# Altium project KAAI3020_TEST.PrjPcb (part 1 of 3)
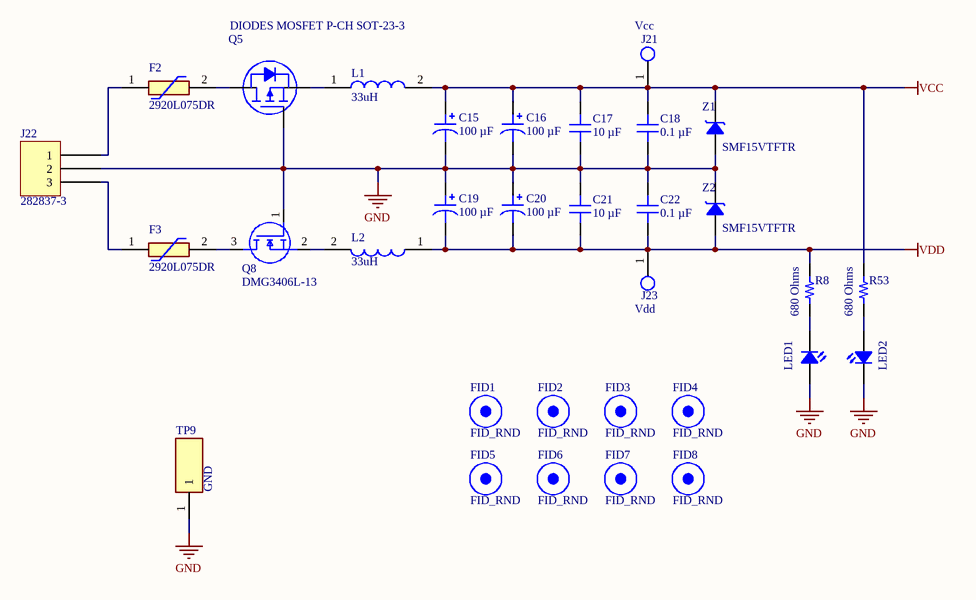
[diagram p0: power.SchDoc]
6 sheets, 253 parts. Net scope: flat (ports and power ports of the same name join across sheets).
Board file: KAAI3020_TESTPcbDoc.PcbDoc
Sheets:
  power.SchDoc
  LDO.SchDoc
  misc_A.SchDoc
  source_A.SchDoc
  source_B.SchDoc
  misc_B.SchDoc

## Sheet power.SchDoc
size A; SheetNumber: 1; SheetTotal: 6

### Parts
C15  100 µF  [CAP ALSMD 8.3MM H10.5MM]
C16  100 µF  [CAP ALSMD 8.3MM H10.5MM]
C17  10 µF  [CAP 1206_3216 - 0.8MM]
C18  0.1 µF  [CAP 1206_3216 - 0.8MM]
C19  100 µF  [CAP ALSMD 8.3MM H10.5MM]
C20  100 µF  [CAP ALSMD 8.3MM H10.5MM]
C21  10 µF  [CAP 1206_3216 - 0.8MM]
C22  0.1 µF  [CAP 1206_3216 - 0.8MM]
F2  2920L075DR  [2920L030DR]
F3  2920L075DR  [2920L030DR]
FID1  FID_RND  [FID_RND]  (no BOM)
FID2  FID_RND  [FID_RND]  (no BOM)
FID3  FID_RND  [FID_RND]  (no BOM)
FID4  FID_RND  [FID_RND]  (no BOM)
FID5  FID_RND  [FID_RND]  (no BOM)
FID6  FID_RND  [FID_RND]  (no BOM)
FID7  FID_RND  [FID_RND]  (no BOM)
FID8  FID_RND  [FID_RND]  (no BOM)
J21  Vcc  [FP-5001-MFG]
J22  282837-3  [TE 282837-3]
J23  Vdd  [FP-5001-MFG]
L1  33uH  [INDPM116102X400N]
L2  33uH  [INDPM116102X400N]
LED1  LTST-C191KRKT  [LEDC1608X55N]  (value not drawn)
LED2  LTST-C191KRKT  [LEDC1608X55N]  (value not drawn)
Q5  DIODES MOSFET P-CH SOT-23-3  [DIODES SOT-23-3]
Q8  DMG3406L-13  [SOT96P240X110-3N]
R8  680 Ohms  [YAGEO RES 1206_3216]
R53  680 Ohms  [YAGEO RES 1206_3216]
TP9  GND  [S175146R]
Z1  SMF15VTFTR  [SMF15VTFTR]
Z2  SMF15VTFTR  [SMF15VTFTR]

### Nets
GND: C15.2 C16.2 C17.1 C18.1 C19.1 C20.1 C21.2 C22.2 J22.2 LED1.2(A) LED2.1(K) Q5.1(G) Q8.1(G) TP9.1 Z1.2 Z2.1
VCC: C15.1 C16.1 C17.2 C18.2 J21.1 L1.2 R53.2 Z1.1
VDD: C19.2 C20.2 C21.1 C22.1 J23.1 L2.1 R8.2 Z2.2
NetF2_1: F2.1 J22.1
NetF2_2: F2.2 Q5.3(D)
NetF3_1: F3.1 J22.3
NetF3_2: F3.2 Q8.3(D)
NetL1_1: L1.1 Q5.2(S)
NetL2_2: L2.2 Q8.2(S)
NetLED1_1: LED1.1(K) R8.1
NetLED2_2: LED2.2(A) R53.1

### Library data of the parts
C15 C16 C19 C20 = 50TZV100M8X10.5: CAP ALUM 100UF 20% 50V SMD; manufacturer: Rubycon; Impedance: 340 mOhms; Lifetime @ Temp.: 2000 Hrs @ 105°C; Polarization: Polar; Ripple Current @ High Frequency: 350 mA @ 100 kHz; Ripple Current @ Low Frequency: 175 mA @ 120 Hz; Surface Mount Land Size: 0.327" L x 0.327" W (8.30mm x 8.30mm); Part Number: 50TZV100M8X10.5; Applications: Automotive; Capacitance: 100 µF; componentlink1description: Datasheet; componentlink1url: http://www.rubycon.co.jp/en/catalog/e_pdfs/aluminum/e_tzv.pdf; componentlink2description: DigiKey Link; componentlink2url: https://www.digikey.com/en/products/detail/rubycon/50TZV100M8X10-5/3134931; Device Package: Radial, Can - SMD; Height - Seated (Max): 0.413" (10.50mm); lastupdated: 6/3/2024 20:15:48; Lifecycle Status: Active; Minimum Order: 1; Mounting Type: Surface Mount; Operating Temperature: -55°C ~ 105°C; Package / Case: Radial, Can - SMD; packaging: TapeAndReel; partid: 7533; Part Status: Active; price: 0.16; Ratings: AEC-Q200; series: TZV; Size / Dimension: 0.315" Dia (8.00mm); Supplier 1: DigiKey; Supplier Part Number 1: 1189-1651-1-ND; Tolerance: ±20%; value: 100 µF; Voltage - Rated: 50 V
C17 C21 = 885012208069: CAP CER 10UF 25V X7R 1206; manufacturer: Würth Elektronik; Tolerance: ±10%; Part Number: 885012208069; Capacitance: 10 µF; Applications: General Purpose; componentlink1description: Datasheet; componentlink1url: https://katalog.we-online.de/pbs/datasheet/885012208069.pdf; componentlink2description: DigiKey Link; componentlink2url: https://www.digikey.com/en/products/detail/würth-elektronik/885012208069/5453429; Device Package: 1206 (3216 Metric); lastupdated: 6/4/2024 19:10:32; Lifecycle Status: Active; Minimum Order: 1; Mounting Type: Surface Mount, MLCC; Operating Temperature: -55°C ~ 125°C; Package / Case: 1206 (3216 Metric); packaging: TapeAndReel; partid: 43199; Part Status: Active; price: 0.40; series: WCAP-CSGP; Size / Dimension: 0.126" L x 0.063" W (3.20mm x 1.60mm); Supplier 1: DigiKey; Supplier Part Number 1: 732-7574-1-ND; Temperature Coefficient: X7R; Thickness (Max): 0.075" (1.90mm); value: 10 µF; Voltage - Rated: 25V
C18 C22 = 885012208087: CAP CER 0.1UF 50V X7R 1206; manufacturer: Würth Elektronik; Tolerance: ±10%; Part Number: 885012208087; Capacitance: 0.1 µF; Applications: General Purpose; componentlink1description: Datasheet; componentlink1url: https://katalog.we-online.de/pbs/datasheet/885012208087.pdf; componentlink2description: DigiKey Link; componentlink2url: https://www.digikey.com/en/products/detail/würth-elektronik/885012208087/5453982; Device Package: 1206 (3216 Metric); lastupdated: 6/4/2024 19:10:27; Lifecycle Status: Active; Minimum Order: 1; Mounting Type: Surface Mount, MLCC; Operating Temperature: -55°C ~ 125°C; Package / Case: 1206 (3216 Metric); packaging: TapeAndReel; partid: 20879; Part Status: Active; price: 0.06; series: WCAP-CSGP; Size / Dimension: 0.126" L x 0.063" W (3.20mm x 1.60mm); Supplier 1: DigiKey; Supplier Part Number 1: 732-8127-1-ND; Temperature Coefficient: X7R; Thickness (Max): 0.035" (0.90mm); value: 0.1 µF; Voltage - Rated: 50V
F2 F3 = 2920L075DR: Resettable Fuse; Manufacturer_Name: LITTELFUSE; Datasheet Link: https://www.littelfuse.com/~/media/electronics/datasheets/resettable_ptcs/littelfuse_ptc_2920l_datasheet.pdf.pdf; Height: 1.25mm; Manufacturer_Part_Number: 2920L075DR; Mouser Part Number: 576-2920L075; Mouser Price/Stock: https://www.mouser.co.uk/ProductDetail/Littelfuse/2920L075DR?qs=SJZ%252BTX%252BI2BR6aMN5vUbCzw%3D%3D; Arrow Part Number: 2920L075DR; Arrow Price/Stock: https://www.arrow.com/en/products/2920l075dr/littelfuse?utm_currency=USD&region=europe
FID1-FID8 = CMP-0288-0A: Fiducial, Round, D=4mm (inner D=1mm); Manufacturer: KONČAR; ManufacturerPartNumber: FID_RND; MountingType: SMD; PartStatus: Active; ValueNumeric: FID_RND; Component Type: Mechanical Parts; Value: FID_RND
J21 J23 = 5001: PC TEST POINT MINIATURE BLACK; Body Material: Bronze; Plating: Silver; Inside Diameter: 1.27mm; Hole Diameter: 1.6mm; Number of Ports: 1; Outside Diameter: 2.54mm; Insulation: Insulated; Insulation Material: Nylon; Mount: Through Hole; RoHS Compliant: Yes; Series: THM; Height: 0.3inch; Termination: Through Hole; Material: Nylon; Packaging: Bulk; Contact Material: Bronze; REACH SVHC: No SVHC; Contact Plating: Silver; Orientation: Straight; Lead Free: Lead Free; Package Quantity: 100; Length: 7.62mm; Flammability Rating: UL94 V-0; Number of Contacts: 1; Diameter: 2.54mm; Housing Color: Black; Color: Black; Supplier 1: Mouser; Supplier Part Number 1: 534-5001
J22 = 282837-3: TERM BLK 3P SIDE ENT 5.08MM PCB; Manufacturer: TE Connectivity AMP Connectors; Current: 13.5 A; Mating Orientation: Horizontal with Board; Number of Levels: 1; Pitch: 0.200" (5.08mm); Positions Per Level: 3; Voltage: 300 V; Wire Gauge: 16-28 AWG; Wire Termination: Screw - Rising Cage Clamp; Part Number: 282837-3; Color: Green; ComponentLink1Description: Datasheet; ComponentLink1URL: https://www.te.com/commerce/DocumentDelivery/DDEController?Action=srchrtrv&DocNm=282837&DocType=Customer+Drawing&DocLang=English; ComponentLink2Description: DigiKey Link; ComponentLink2URL: https://www.digikey.com/en/products/detail/te-connectivity-amp-connectors/282837-3/2187974; Features: Interlocking (Side); LastUpdated: 6/21/2022 15:00:39; Lifecycle Status: Active; Minimum Order: 1; Mounting Type: Through Hole; Packaging: Tray; Part Status: Active; Price: 0.47; Series: Buchanan; Supplier 1: DigiKey; Supplier Part Number 1: A113321-ND
L1 L2 = AMRM00101040330MA1: Inductor; Manufacturer_Name: Pulse Electronics; Datasheet Link: https://productfinder.pulseelectronics.com/api/open/part-attachments/datasheet/amrm00101040330ma1; Height: 4mm; Manufacturer_Part_Number: AMRM00101040330MA1; Mouser Part Number: 673-AMRM101040330MA1; Mouser Price/Stock: https://www.mouser.co.uk/ProductDetail/Pulse-Electronics/AMRM00101040330MA1?qs=HoCaDK9Nz5eI6M5ad0CXDA%3D%3D; Value: 33uH
LED1 LED2 = LTST-C191KRKT: LED; Manufacturer_Name: Lite-On; Datasheet Link: http://www.mouser.com/ds/2/239/S_110_LTST-C191KRKT-539838.pdf; Height: 0.55mm; Manufacturer_Part_Number: LTST-C191KRKT; Mouser Part Number: 859-LTST-C191KRKT; Mouser Price/Stock: https://www.mouser.co.uk/ProductDetail/LITEON/LTST-C191KRKT?qs=BAIUz4Y8PJBLfOhzue0q%252BA%3D%3D; Arrow Part Number: LTST-C191KRKT; Arrow Price/Stock: https://www.arrow.com/en/products/ltst-c191krkt/lite-on-technology?utm_currency=USD&region=nac
Q5 = DMP3125L-7: MOSFET P-CH 30V 2.5A SOT23; Manufacturer: Diodes Incorporated; Current - Continuous Drain (Id) @ 25°C: 2.5A (Ta); Drive Voltage (Max Rds On,  Min Rds On): 4.5V, 10V; FET Type: P-Channel; Gate Charge (Qg) (Max) @ Vgs: 3.1 nC @ 4.5 V; Input Capacitance (Ciss) (Max) @ Vds: 254 pF @ 25 V; Power Dissipation (Max): 650mW (Ta); Rds On (Max) @ Id, Vgs: 95mOhm @ 3.8A, 10V; Vgs (Max): ±20V; Vgs(th) (Max) @ Id: 2.1V @ 250µA; Part Number: DMP3125L-7; ComponentLink1Description: Datasheet; ComponentLink1URL: https://www.diodes.com/assets/Datasheets/DMP3125L.pdf; ComponentLink2Description: DigiKey Link; ComponentLink2URL: https://www.digikey.com/en/products/detail/diodes-incorporated/DMP3125L-7/8275358; Drain to Source Voltage (Vdss): 30 V; LastUpdated: 6/3/2024 20:15:20; Lifecycle Status: Active; Minimum Order: 1; Mounting Type: Surface Mount; Operating Temperature: -55°C ~ 150°C (TJ); Package / Case: TO-236-3, SC-59, SOT-23-3; Packaging: TapeAndReel; Part Status: Active; Price: 0.05; Series: -; Supplier 1: DigiKey; Supplier Part Number 1: DMP3125L-7DICT-ND; Supplier Device Package: SOT-23-3; Technology: MOSFET (Metal Oxide)
Q8 = DMG3406L-13: MOSFET (N-Channel); Manufacturer_Name: Diodes Incorporated; Datasheet Link: https://www.diodes.com//assets/Datasheets/DMG3406L.pdf; Height: 1.1mm; Manufacturer_Part_Number: DMG3406L-13; Mouser Part Number: 621-DMG3406L-13; Mouser Price/Stock: https://www.mouser.co.uk/ProductDetail/Diodes-Incorporated/DMG3406L-13?qs=BvpHGKeVh3r%252BRZTTCOfjpg%3D%3D; Arrow Part Number: DMG3406L-13; Arrow Price/Stock: https://www.arrow.com/en/products/dmg3406l-13/diodes-incorporated?region=nac
R8 R53 = RT1206FRE07680RL: RES SMD 680 OHM 1% 1/4W 1206; Manufacturer: Yageo; Power (Watts): 0.25W, 1/4W; Temperature Coefficient: ±50ppm/°C; Part Number: RT1206FRE07680RL; ComponentLink1Description: Datasheet; ComponentLink1URL: https://www.yageo.com/upload/media/product/productsearch/datasheet/rchip/PYu-RT_1-to-0.01_RoHS_L_12.pdf; ComponentLink2Description: DigiKey Link; ComponentLink2URL: https://www.digikey.com/en/products/detail/yageo/RT1206FRE07680RL/1083328; Composition: Thin Film; Device Package: 1206 (3216 Metric); Height - Seated (Max): 0.026" (0.65mm); LastUpdated: 7/25/2024 09:21:22; Lifecycle Status: Active; Minimum Order: 1; Number of Terminations: 2; Operating Temperature: -55°C ~ 155°C; Package / Case: 1206 (3216 Metric); Packaging: TapeAndReel; PartId: 58036; Part Status: Active; Price: 0.01; Resistance: 680 Ohms; Series: RT; Size / Dimension: 0.122" L x 0.063" W (3.10mm x 1.60mm); Supplier 1: DigiKey; Supplier Part Number 1: 13-RT1206FRE07680RLCT-ND; Supplier Device Package: 1206; Tolerance: ±1%; Value: 680 Ohms
TP9 = S1751-46R: Test Point; Manufacturer_Name: Harwin; Datasheet Link: https://cdn.harwin.com/pdfs/S1751R.pdf; Height: 2mm; Manufacturer_Part_Number: S1751-46R; Mouser Part Number: 855-S1751-46R; Mouser Price/Stock: https://www.mouser.co.uk/ProductDetail/Harwin/S1751-46R?qs=l6ZPVqNVZb71wETAKrfRig%3D%3D
Z1 Z2 = SMF15VTFTR: Zener Diode; Manufacturer_Name: ROHM Semiconductor; Datasheet Link: https://fscdn.rohm.com/en/products/databook/datasheet/discrete/diode/zener/smf15vtftr-e.pdf; Height: 0.9mm; Manufacturer_Part_Number: SMF15VTFTR; Mouser Part Number: 755-SMF15VTFTR; Mouser Price/Stock: https://www.mouser.co.uk/ProductDetail/ROHM-Semiconductor/SMF15VTFTR?qs=HXFqYaX1Q2wU8NS9uLe0xg%3D%3D

## Sheet LDO.SchDoc
size 381 x 241 mm; SheetNumber: 2; SheetTotal: 6
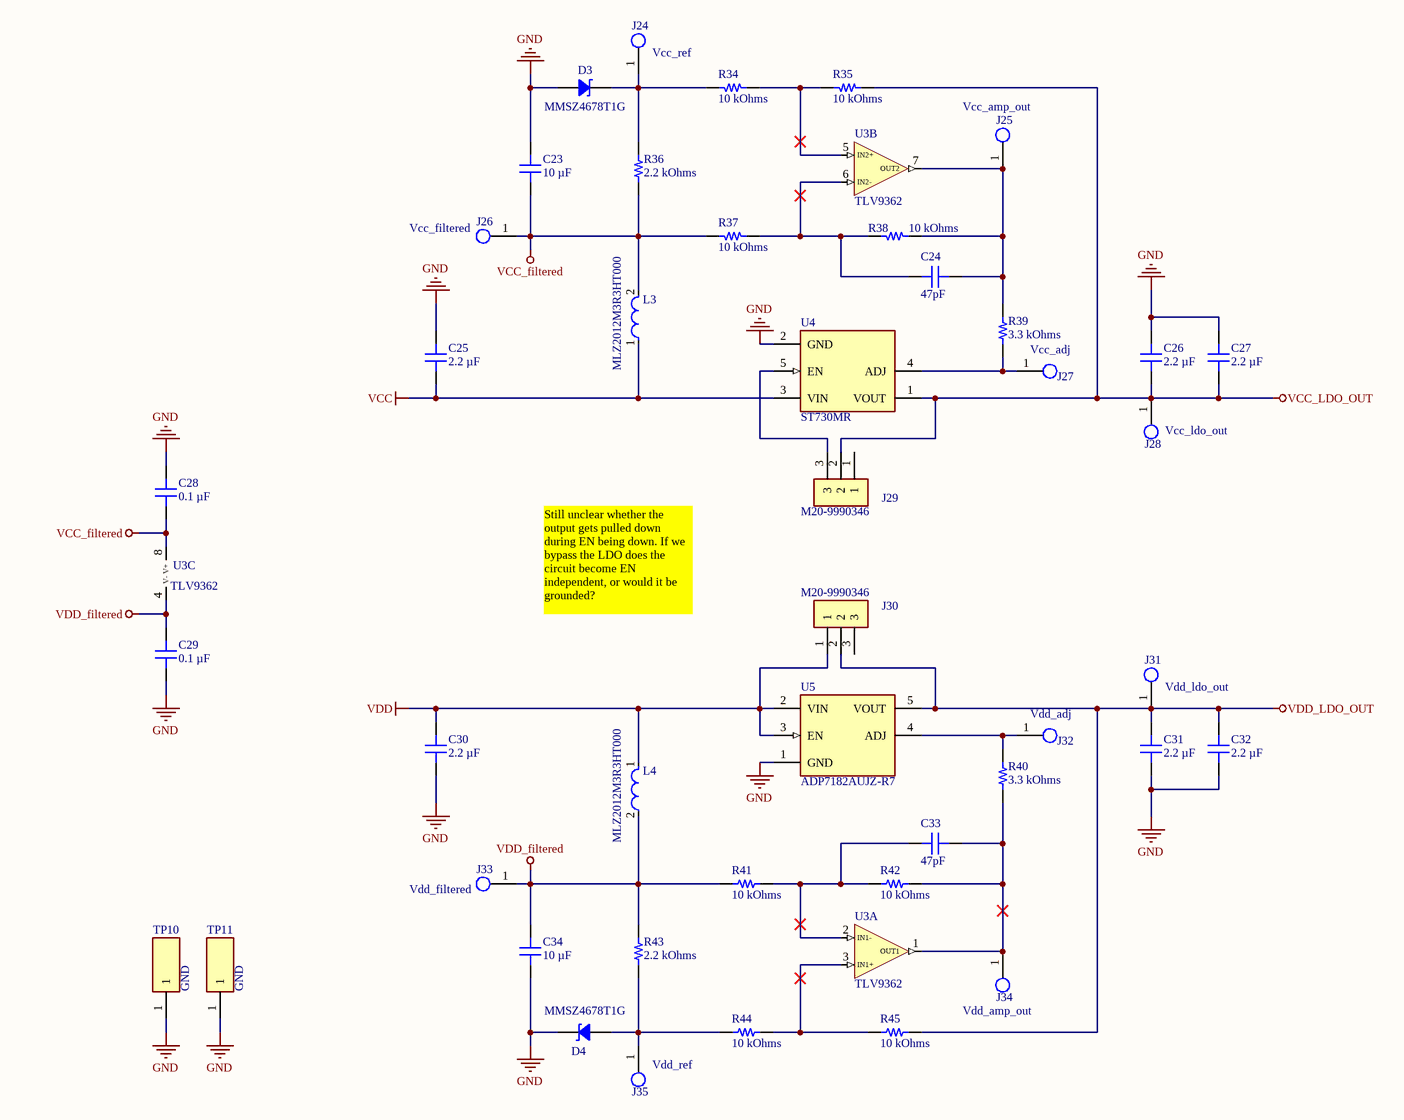
[diagram p1: LDO.SchDoc]

### Parts
C23  10 µF  [CAP 1206_3216 - 0.8MM]
C24  47pF  [CAP 1206_3216 - 1.8MM]
C25  2.2 µF  [CAP 1206_3216 - 0.8MM]
C26  2.2 µF  [CAP 1206_3216 - 0.8MM]
C27  2.2 µF  [CAP 1206_3216 - 0.8MM]
C28  0.1 µF  [CAP 1206_3216 - 0.8MM]
C29  0.1 µF  [CAP 1206_3216 - 0.8MM]
C30  2.2 µF  [CAP 1206_3216 - 0.8MM]
C31  2.2 µF  [CAP 1206_3216 - 0.8MM]
C32  2.2 µF  [CAP 1206_3216 - 0.8MM]
C33  47pF  [CAP 1206_3216 - 1.8MM]
C34  10 µF  [CAP 1206_3216 - 0.8MM]
D3  MMSZ4678T1G  [SOD3716X135N]
D4  MMSZ4678T1G  [SOD3716X135N]
J24  Vcc_ref  [FP-5001-MFG]
J25  Vcc_amp_out  [FP-5001-MFG]
J26  Vcc_filtered  [FP-5001-MFG]
J27  Vcc_adj  [FP-5001-MFG]
J28  Vcc_ldo_out  [FP-5001-MFG]
J29  M20-9990346  [HDRV3W64P0X254_1X3_762X254X864P - duplicate]
J30  M20-9990346  [HDRV3W64P0X254_1X3_762X254X864P - duplicate]
J31  Vdd_ldo_out  [FP-5001-MFG]
J32  Vdd_adj  [FP-5001-MFG]
J33  Vdd_filtered  [FP-5001-MFG]
J34  Vdd_amp_out  [FP-5001-MFG]
J35  Vdd_ref  [FP-5001-MFG]
L3  MLZ2012M3R3HT000  [FP-MLZ2012-1_25-IPC_B]
L4  MLZ2012M3R3HT000  [FP-MLZ2012-1_25-IPC_B]
R34  10 kOhms  [YAGEO RES 1206_3216]
R35  10 kOhms  [YAGEO RES 1206_3216]
R36  2.2 kOhms  [YAGEO RES 1206_3216]
R37  10 kOhms  [YAGEO RES 1206_3216]
R38  10 kOhms  [YAGEO RES 1206_3216]
R39  3.3 kOhms  [YAGEO RES 1206_3216]
R40  3.3 kOhms  [YAGEO RES 1206_3216]
R41  10 kOhms  [YAGEO RES 1206_3216]
R42  10 kOhms  [YAGEO RES 1206_3216]
R43  2.2 kOhms  [YAGEO RES 1206_3216]
R44  10 kOhms  [YAGEO RES 1206_3216]
R45  10 kOhms  [YAGEO RES 1206_3216]
TP10  GND  [S175146R]
TP11  GND  [S175146R]
U3  TLV9362  [SOIC8-127P600X175-8N]  (parts A,B,C of 3)
U4  ST730MR  [FP-UJ-5-IPC_B]
U5  ADP7182AUJZ-R7  [FP-UJ-5-IPC_B]

### Nets
GND: C23.1 C25.1 C26.1 C27.1 C28.2 C29.1 C30.1 C31.1 C32.1 C34.1 D3.1 D4.2 TP10.1 TP11.1 U4.2(GND) U5.1(GND)
VCC: C25.2 L3.1 U4.3(VIN)
VCC_filtered: C23.2 C28.1 J26.1 L3.2 R36.1 R37.2 U3.8(V+)
VCC_LDO_OUT: C26.2 C27.2 J28.1 J29.2 R35.1 U4.1(VOUT)
VDD: C30.2 J30.1 L4.1 U5.2(VIN) U5.3(EN)
VDD_filtered: C29.2 C34.2 J33.1 L4.2 R41.2 R43.2 U3.4(V-)
VDD_LDO_OUT: C31.2 C32.2 J30.2 J31.1 R45.1 U5.5(VOUT)
NetC24_1: C24.1 R37.1 R38.2 U3.6(IN2-)
NetC24_2: C24.2 J25.1 R38.1 R39.1 U3.7(OUT2)
NetC33_1: C33.1 R41.1 R42.2 U3.2(IN1-)
NetC33_2: C33.2 J34.1 R40.2 R42.1 U3.1(OUT1)
NetD3_2: D3.2 J24.1 R34.2 R36.2
NetD4_1: D4.1 J35.1 R43.1 R44.2
NetJ27_1: J27.1 R39.2 U4.4(ADJ)
NetJ29_3: J29.3 U4.5(EN)
NetJ32_1: J32.1 R40.1 U5.4(ADJ)
NetR34_1: R34.1 R35.2 U3.5(IN2+)
NetR44_1: R44.1 R45.2 U3.3(IN1+)

Not connected (* = marked no-connect by the designer): J29 1; J30 3

### Notes on the sheet
- Still unclear whether the output gets pulled down during EN being down. If we bypass the LDO does the circuit become EN independent, or would it be grounded?
- Type @ to refer to a designator or a net

### Library data of the parts
C23 C34 = 885012208069: as C17 on sheet power; Part Number: 885012208069; Capacitance: 10 µF; Applications: General Purpose; componentlink1description: Datasheet; componentlink1url: https://katalog.we-online.de/pbs/datasheet/885012208069.pdf; componentlink2description: DigiKey Link; componentlink2url: https://www.digikey.com/en/products/detail/würth-elektronik/885012208069/5453429; Device Package: 1206 (3216 Metric); lastupdated: 6/4/2024 19:10:32; Lifecycle Status: Active; Minimum Order: 1; Mounting Type: Surface Mount, MLCC; Operating Temperature: -55°C ~ 125°C; Package / Case: 1206 (3216 Metric); packaging: TapeAndReel; partid: 43199; Part Status: Active; price: 0.40; series: WCAP-CSGP; Size / Dimension: 0.126" L x 0.063" W (3.20mm x 1.60mm); Supplier 1: DigiKey; Supplier Part Number 1: 732-7574-1-ND; Temperature Coefficient: X7R; Thickness (Max): 0.075" (1.90mm); value: 10 µF; Voltage - Rated: 25V
C24 C33 = 1206AA470KAT1A: CAP CER 47PF 1KV C0G/NP0 1206; manufacturer: AVX Corporation; Temperature Coefficient: C0G, NP0; Tolerance: ±10%; Voltage - Rated: 1000V (1kV); Part Number: 1206AA470KAT1A; Capacitance: 47pF; Applications: General Purpose; componentlink1description: Datasheet; componentlink1url: http://datasheets.avx.com/AVX-HV_MLCC.pdf; componentlink2description: DigiKey Link; componentlink2url: http://digikey.com/product-detail/en/avx-corporation/1206AA470KAT1A/478-2949-1-ND/808148; Device Package: 1206 (3216 Metric); Features: High Voltage; lastupdated: 9/2/2020 01:05:31; Lifecycle Status: Active; Minimum Order: 1; Mounting Type: Surface Mount, MLCC; Operating Temperature: -55°C ~ 125°C; Package / Case: 1206 (3216 Metric); packaging: TapeAndReel; partid: 21825; Part Status: Active; price: 0.11; series: -; Size / Dimension: 0.130" L x 0.063" W (3.30mm x 1.60mm); Supplier 1: DigiKey; Supplier Part Number 1: 478-2949-1-ND; Thickness (Max): 0.071" (1.80mm); value: 47pF
C25-C27 C30-C32 = 885382208001: CAP CER 2.2UF 25V X7R 1206; manufacturer: Würth Elektronik; Tolerance: ±10%; Part Number: 885382208001; Capacitance: 2.2 µF; Applications: Boardflex Sensitive; componentlink2description: DigiKey Link; componentlink2url: https://www.digikey.com/en/products/detail/würth-elektronik/885382208001/9816354; Device Package: 1206 (3216 Metric); Features: Soft Termination; lastupdated: 6/4/2024 19:10:38; Lifecycle Status: Active; Minimum Order: 1; Mounting Type: Surface Mount, MLCC; Operating Temperature: -55°C ~ 125°C; Package / Case: 1206 (3216 Metric); packaging: TapeAndReel; partid: 45904; Part Status: Active; price: 0.35; series: WCAP-CSST; Size / Dimension: 0.126" L x 0.063" W (3.20mm x 1.60mm); Supplier 1: DigiKey; Supplier Part Number 1: 732-13199-1-ND; Temperature Coefficient: X7R; Thickness (Max): 0.083" (2.10mm); value: 2.2 µF; Voltage - Rated: 25V
C28 C29 = 885012208087: as C18 on sheet power; Part Number: 885012208087; Capacitance: 0.1 µF; Applications: General Purpose; componentlink1description: Datasheet; componentlink1url: https://katalog.we-online.de/pbs/datasheet/885012208087.pdf; componentlink2description: DigiKey Link; componentlink2url: https://www.digikey.com/en/products/detail/würth-elektronik/885012208087/5453982; Device Package: 1206 (3216 Metric); lastupdated: 6/4/2024 19:10:27; Lifecycle Status: Active; Minimum Order: 1; Mounting Type: Surface Mount, MLCC; Operating Temperature: -55°C ~ 125°C; Package / Case: 1206 (3216 Metric); packaging: TapeAndReel; partid: 20879; Part Status: Active; price: 0.06; series: WCAP-CSGP; Size / Dimension: 0.126" L x 0.063" W (3.20mm x 1.60mm); Supplier 1: DigiKey; Supplier Part Number 1: 732-8127-1-ND; Temperature Coefficient: X7R; Thickness (Max): 0.035" (0.90mm); value: 0.1 µF; Voltage - Rated: 50V
D3 D4 = MMSZ4678T1G: Zener Diode; Manufacturer_Name: onsemi; Datasheet Link: http://www.onsemi.com/pub/Collateral/MMSZ4678T1-D.PDF; Height: 1.35mm; Manufacturer_Part_Number: MMSZ4678T1G; Mouser Part Number: 863-MMSZ4678T1G; Mouser Price/Stock: https://www.mouser.co.uk/ProductDetail/onsemi/MMSZ4678T1G?qs=P4IOph%252Bbot8vK8FZ3ltvyA%3D%3D; Arrow Part Number: MMSZ4678T1G; Arrow Price/Stock: https://www.arrow.com/en/products/mmsz4678t1g/on-semiconductor?utm_currency=USD&region=europe
J24-J28 J31-J35 = 5001: as J21 on sheet power; Insulation Material: Nylon; Mount: Through Hole; RoHS Compliant: Yes; Series: THM; Height: 0.3inch; Termination: Through Hole; Material: Nylon; Packaging: Bulk; Contact Material: Bronze; REACH SVHC: No SVHC; Contact Plating: Silver; Orientation: Straight; Lead Free: Lead Free; Package Quantity: 100; Length: 7.62mm; Flammability Rating: UL94 V-0; Number of Contacts: 1; Diameter: 2.54mm; Housing Color: Black; Color: Black; Supplier 1: Mouser; Supplier Part Number 1: 534-5001
J29 J30 = M20-9990346: Connector; Manufacturer_Name: Harwin; Datasheet Link: https://cdn.harwin.com/pdfs/M20-999.pdf; Height: 8.64mm; Manufacturer_Part_Number: M20-9990346; Mouser Part Number: 855-M20-9990346; Mouser Price/Stock: https://www.mouser.co.uk/ProductDetail/Harwin/M20-9990346?qs=ulE8k0yEMYbyhQ3uXpFs8Q%3D%3D
L3 L4 = MLZ2012M3R3HT000: Shielded Multilayer Inductor 3.3uH ±20% 500mA 260mΩ SMD 0805; Saturation Current: 350mA; Core Material: Ferrite; DC Resistance (DCR): 260mR; RoHS Compliant: Yes; Mount: Surface Mount; Case Code (Metric): 2012; Case/Package: 0805; Min Operating Temperature: -55°C; Package Quantity: 2000; Shielding: Shielded; Current Rating: 500mA; Height - Seated (Max): 0.057inch; Case Code (Imperial): 0805; Width: 0.049inch; Tolerance: 20%; Packaging: Tape and Reel; Inductance: 3.3uH; Lead Free: Lead Free; Max Operating Temperature: 125°C; Length: 0.079inch; Value: 3.3uH
R34 R35 R37 R38 R41 R42 R44 R45 = RT1206FRE0710KL: RES SMD 10K OHM 1% 1/4W 1206; Manufacturer: Yageo; Power (Watts): 0.25W, 1/4W; Temperature Coefficient: ±50ppm/°C; Part Number: RT1206FRE0710KL; ComponentLink1Description: Datasheet; ComponentLink1URL: https://www.yageo.com/upload/media/product/productsearch/datasheet/rchip/PYu-RT_1-to-0.01_RoHS_L_11.pdf; ComponentLink2Description: DigiKey Link; ComponentLink2URL: https://www.digikey.com/en/products/detail/yageo/RT1206FRE0710KL/1082868; Composition: Thin Film; Device Package: 1206 (3216 Metric); Height - Seated (Max): 0.026" (0.65mm); LastUpdated: 7/25/2024 09:21:28; Lifecycle Status: Active; Minimum Order: 1; Number of Terminations: 2; Operating Temperature: -55°C ~ 155°C; Package / Case: 1206 (3216 Metric); Packaging: TapeAndReel; PartId: 38903; Part Status: Active; Price: 0.01; Resistance: 10 kOhms; Series: RT; Size / Dimension: 0.122" L x 0.063" W (3.10mm x 1.60mm); Supplier 1: DigiKey; Supplier Part Number 1: YAG1242CT-ND; Supplier Device Package: 1206; Tolerance: ±1%; Value: 10 kOhms
R36 R43 = RT1206FRE072K2L: RES SMD 2.2K OHM 1% 1/4W 1206; Manufacturer: Yageo; Power (Watts): 0.25W, 1/4W; Temperature Coefficient: ±50ppm/°C; Part Number: RT1206FRE072K2L; ComponentLink1Description: Datasheet; ComponentLink1URL: https://www.yageo.com/upload/media/product/productsearch/datasheet/rchip/PYu-RT_1-to-0.01_RoHS_L_12.pdf; ComponentLink2Description: DigiKey Link; ComponentLink2URL: https://www.digikey.com/en/products/detail/yageo/RT1206FRE072K2L/1083103; Composition: Thin Film; Device Package: 1206 (3216 Metric); Height - Seated (Max): 0.026" (0.65mm); LastUpdated: 7/25/2024 09:21:22; Lifecycle Status: Active; Minimum Order: 1; Number of Terminations: 2; Operating Temperature: -55°C ~ 155°C; Package / Case: 1206 (3216 Metric); Packaging: TapeAndReel; PartId: 58391; Part Status: Active; Price: 0.01; Resistance: 2.2 kOhms; Series: RT; Size / Dimension: 0.122" L x 0.063" W (3.10mm x 1.60mm); Supplier 1: DigiKey; Supplier Part Number 1: 13-RT1206FRE072K2LCT-ND; Supplier Device Package: 1206; Tolerance: ±1%; Value: 2.2 kOhms
R39 R40 = RT1206FRE073K3L: RES SMD 3.3K OHM 1% 1/4W 1206; Manufacturer: Yageo; Power (Watts): 0.25W, 1/4W; Temperature Coefficient: ±50ppm/°C; Part Number: RT1206FRE073K3L; ComponentLink1Description: Datasheet; ComponentLink1URL: https://www.yageo.com/upload/media/product/productsearch/datasheet/rchip/PYu-RT_1-to-0.01_RoHS_L_12.pdf; ComponentLink2Description: DigiKey Link; ComponentLink2URL: https://www.digikey.com/en/products/detail/yageo/RT1206FRE073K3L/1083187; Composition: Thin Film; Device Package: 1206 (3216 Metric); Height - Seated (Max): 0.026" (0.65mm); LastUpdated: 7/25/2024 09:21:22; Lifecycle Status: Active; Minimum Order: 1; Number of Terminations: 2; Operating Temperature: -55°C ~ 155°C; Package / Case: 1206 (3216 Metric); Packaging: TapeAndReel; PartId: 58380; Price: 0.01; Resistance: 3.3 kOhms; Series: RT; Size / Dimension: 0.122" L x 0.063" W (3.10mm x 1.60mm); Supplier 1: DigiKey; Supplier Part Number 1: 13-RT1206FRE073K3LCT-ND; Supplier Device Package: 1206; Tolerance: ±1%; Value: 3.3 kOhms; Part Status: Active
TP10 TP11 = S1751-46R: Test Point; Manufacturer_Name: Harwin; Datasheet Link: https://cdn.harwin.com/pdfs/S1751R.pdf; Height: 2mm; Manufacturer_Part_Number: S1751-46R; Mouser Part Number: 855-S1751-46R; Mouser Price/Stock: https://www.mouser.co.uk/ProductDetail/Harwin/S1751-46R?qs=l6ZPVqNVZb71wETAKrfRig%3D%3D
U3 = TLV9362: TLV936x 10-MHz, 40-V, RRO, Operational Amplifie; ComponentLink1Description: Datasheet; ComponentLink1URL: https://www.ti.com/lit/ds/symlink/tlv9362.pdf
U5 = ADP7182: IC REG LIN NEG ADJ 200MA 5TSOT; Manufacturer: Analog Devices; Number Of Outputs: 1; Min Supply Voltage: -2.7V; Max Junction Temp: +125°C; Dropout Voltage: -185mV; Output Current: -200mA; Max Supply Voltage: -28V; Output Voltage: -1.22/-27.815V; Nominal Supply Current: -33/-650uA; Output Type: AdjustableProgrammable; Accuracy Percentage: 1%; RoHS: TRUE; Ambient Temperature Range Low: -40°C; Digikey Description: IC REG LIN NEG ADJ 200MA 5TSOT; Device Class L3: Voltage Regulators - Linear; Ambient Temperature Range High: +85°C; Manufacturer Part Number: ADP7182AUJZ-R7; ComponentLink2URL: https://www.analog.com/media/en/technical-documentation/data-sheets/ADP7182.pdf; Ipc Land Pattern Name: SOT95P280X100-5; Temperature Range Low: -40°C; ComponentLink2Description: Datasheet; Mouser Description: LDO Regulator Neg -1.22V to -27V 0.2A 5-Pin TSOT T/R; Category: IC; Automotive: No; Device Class L1: Integrated Circuits (ICs); Temperature: -40°C to +125°C; Octopart: https://octopart.com/adp7182aujz-r7-analog+devices-21054665; Device Class L2: Power Management ICs; Height: 1mm; Package: UJ-5; Temperature Range High: +125°C; Lead Free: Yes

## Sheet misc_A.SchDoc
size 381 x 241 mm; SheetNumber: 3; SheetTotal: 6
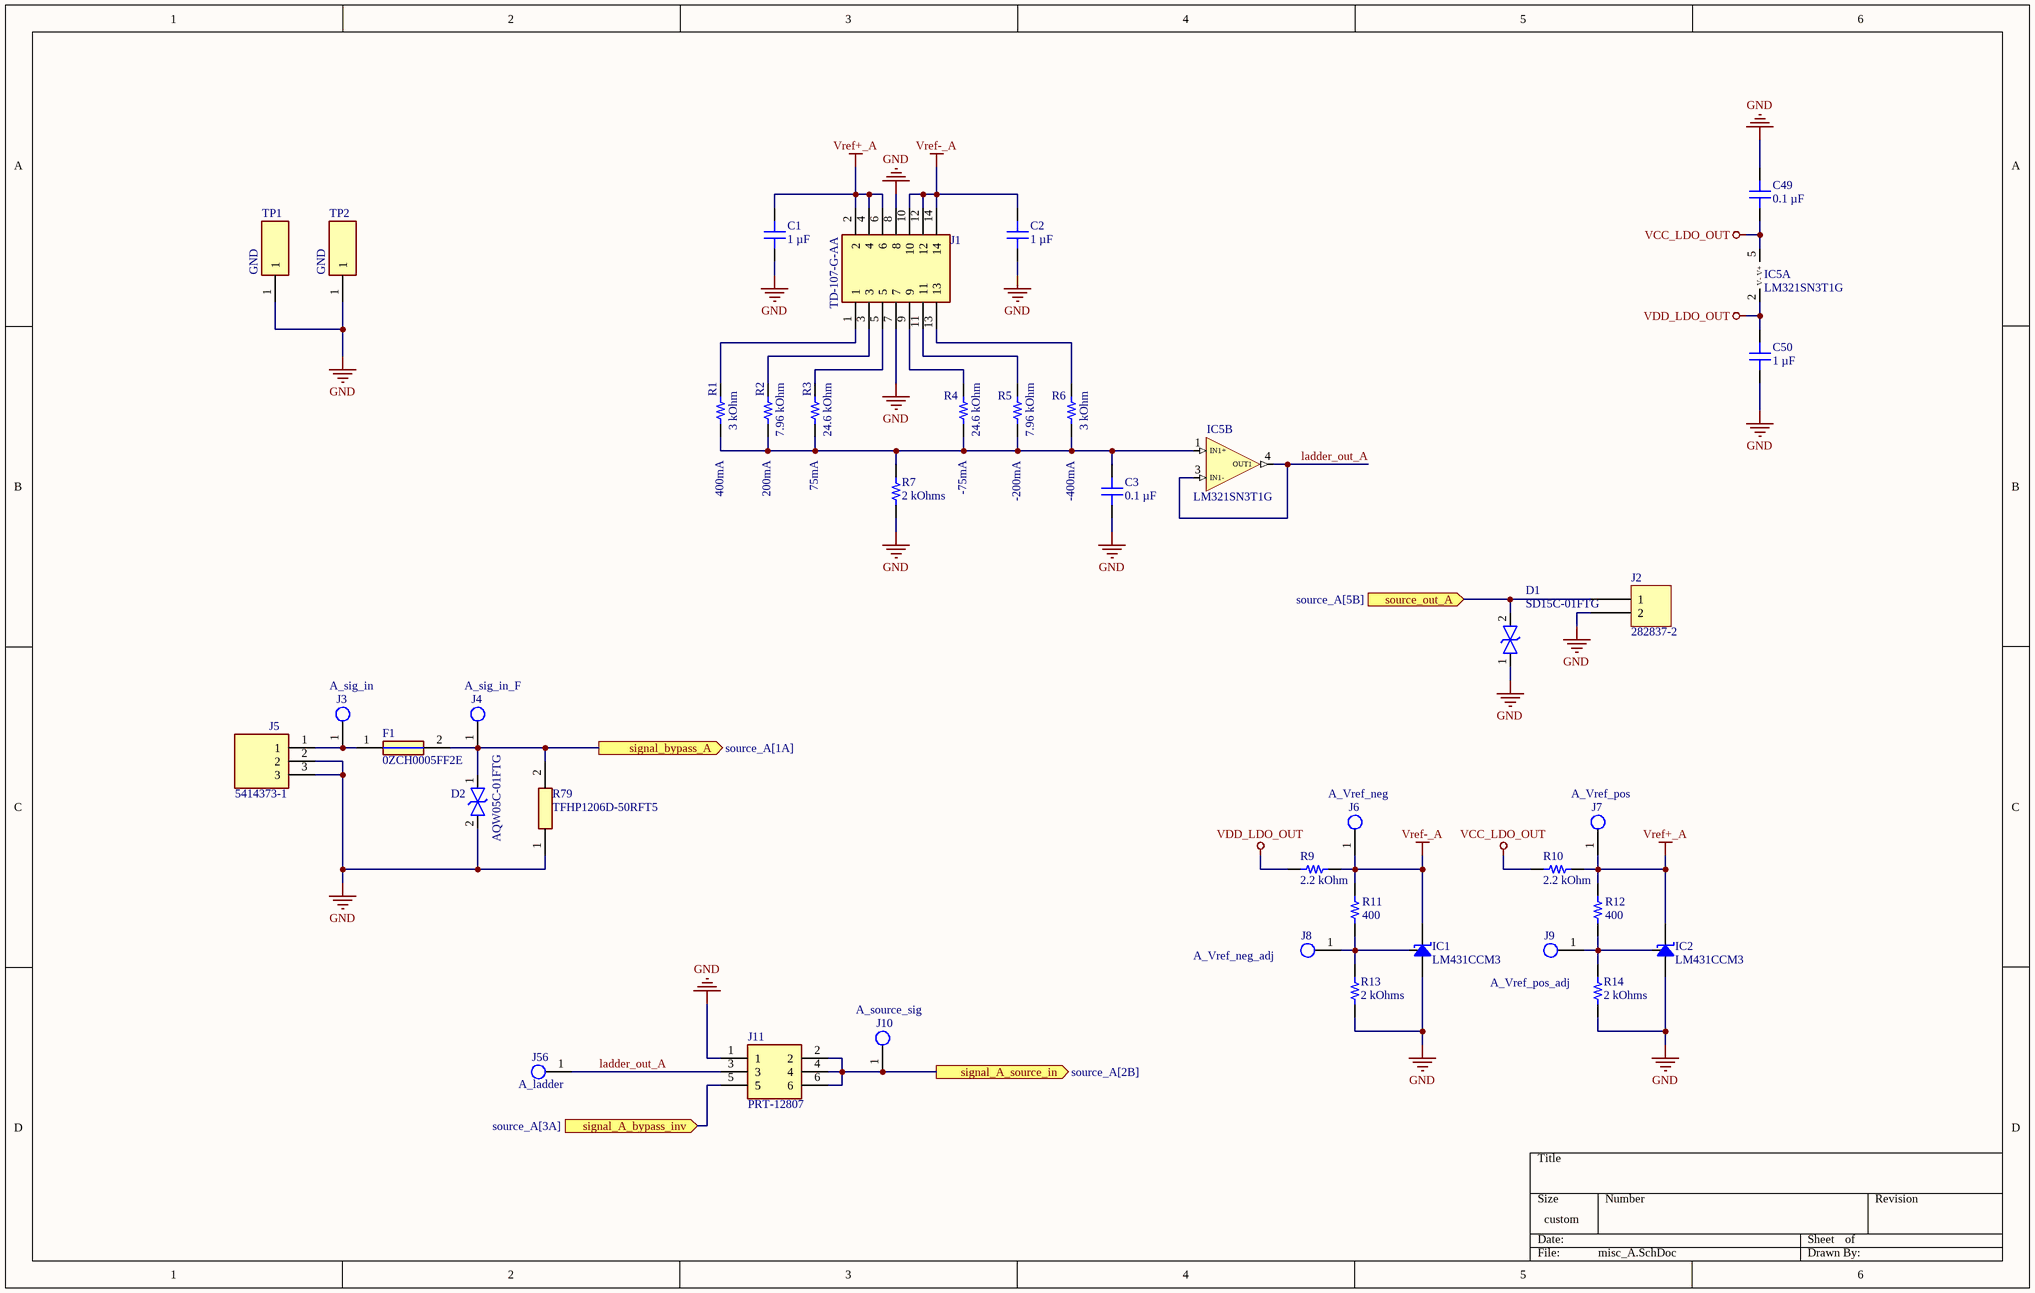
[diagram p2: misc_A.SchDoc]

### Parts
C1  1 µF  [CAP 1206_3216 - 0.8MM]
C2  1 µF  [CAP 1206_3216 - 0.8MM]
C3  0.1 µF  [CAP 1206_3216 - 0.8MM]
C49  0.1 µF  [CAP 1206_3216 - 0.8MM]
C50  1 µF  [CAP 1206_3216 - 0.8MM]
D1  SD15C-01FTG  [SD15C01FTG]
D2  AQW05C-01FTG  [SOD2613X100N]
F1  0ZCH0005FF2E  [FUSC3226X115N]
IC1  LM431CCM3  [SOT96P240X110-3N]
IC2  LM431CCM3  [SOT96P240X110-3N]
IC5  LM321SN3T1G  [SOT95P275X110-5N]  (parts A,B of 2)
J1  TD-107-G-AA  [HDRV14W46P254_2X7_1778X508X818P]
J2  282837-2  [TE 282837-2]
J3  A_sig_in  [FP-5001-MFG]
J4  A_sig_in_F  [FP-5001-MFG]
J5  5414373-1  [54143731]
J6  A_Vref_neg  [FP-5001-MFG]
J7  A_Vref_pos  [FP-5001-MFG]
J8  A_Vref_neg_adj  [FP-5001-MFG]
J9  A_Vref_pos_adj  [FP-5001-MFG]
J10  A_source_sig  [FP-5001-MFG]
J11  PRT-12807  [HDRV6W82P254_2X3_762X500X884P]
J56  A_ladder  [FP-5001-MFG]
R1  3 kOhm  [ERA3AEB101V]
R2  7.96 kOhm  [ERA3AEB101V]
R3  24.6 kOhm  [ERA3AEB101V]
R4  24.6 kOhm  [ERA3AEB101V]
R5  7.96 kOhm  [ERA3AEB101V]
R6  3 kOhm  [ERA3AEB101V]
R7  2 kOhms  [RES 1206_3216]
R9  2.2 kOhm  [RESC3116X65N]
R10  2.2 kOhm  [RESC3116X65N]
R11  400  [RESC3116X65N]
R12  400  [RESC3116X65N]
R13  2 kOhms  [RES 1206_3216]
R14  2 kOhms  [RES 1206_3216]
R79  TFHP1206D-50RFT5  [RESC3016X58N]
TP1  GND  [S175146R]
TP2  GND  [S175146R]

### Ports
signal_A_bypass_inv (in, see source_A[3A]), signal_A_source_in (out, see source_A[2B]), signal_bypass_A (out, see source_A[1A]), source_out_A (in, see source_A[5B])

### Nets
GND: C1.2 C2.1 C3.2 C49.1 C50.2 D1.1 D2.2 IC1.2(Anode) IC2.2(Anode) J1.7 J1.8 J2.2 J5.2 J5.3 J11.1 R7.1 R13.1 R14.1 R79.1 TP1.1 TP2.1
VCC_LDO_OUT: C49.2 IC5.5(V+) R10.2
VDD_LDO_OUT: C50.1 IC5.2(V-) R9.2
Vref+_A: C1.1 IC2.1(Cathode) J1.2 J1.4 J1.6 J7.1 R10.1 R12.2
Vref-_A: C2.2 IC1.1(Cathode) J1.10 J1.12 J1.14 J6.1 R9.1 R11.2
ladder_out_A: IC5.3(IN1-) IC5.4(OUT1) J11.3 J56.1
NetC3_1: C3.1 IC5.1(IN1+) R1.1 R2.1 R3.1 R4.1 R5.1 R6.1 R7.2
NetD1_2: D1.2 J2.1 ; port source_out_A
NetD2_1: D2.1 F1.2 J4.1 R79.2 ; port signal_bypass_A
NetF1_1: F1.1 J3.1 J5.1
NetIC1_3: IC1.3(Ref) J8.1 R11.1 R13.2
NetIC2_3: IC2.3(Ref) J9.1 R12.1 R14.2
NetJ1_1: J1.1 R1.2
NetJ1_3: J1.3 R2.2
NetJ1_5: J1.5 R3.2
NetJ1_9: J1.9 R4.2
NetJ1_11: J1.11 R5.2
NetJ1_13: J1.13 R6.2
NetJ10_1: J10.1 J11.2 J11.4 J11.6 ; port signal_A_source_in
NetJ11_5: J11.5 ; port signal_A_bypass_inv

### Notes on the sheet
- 400mA
- 200mA
- 75mA
- -75mA
- -200mA
- -400mA

### Library data of the parts
C1 C2 C50 = 885012208093: CAP CER 1UF 50V X7R 1206; manufacturer: Würth Elektronik; Tolerance: ±10%; Part Number: 885012208093; Capacitance: 1 µF; Applications: General Purpose; componentlink1description: Datasheet; componentlink1url: https://katalog.we-online.de/pbs/datasheet/885012208093.pdf; componentlink2description: DigiKey Link; componentlink2url: https://www.digikey.com/en/products/detail/würth-elektronik/885012208093/5453432; Device Package: 1206 (3216 Metric); lastupdated: 6/4/2024 19:10:33; Lifecycle Status: Active; Minimum Order: 1; Mounting Type: Surface Mount, MLCC; Operating Temperature: -55°C ~ 125°C; Package / Case: 1206 (3216 Metric); packaging: TapeAndReel; partid: 39665; Part Status: Active; price: 0.10; series: WCAP-CSGP; Size / Dimension: 0.126" L x 0.063" W (3.20mm x 1.60mm); Supplier 1: DigiKey; Supplier Part Number 1: 732-7577-1-ND; Temperature Coefficient: X7R; Thickness (Max): 0.075" (1.90mm); value: 1 µF; Voltage - Rated: 50V
C3 C49 = 885012208087: as C18 on sheet power; Part Number: 885012208087; Capacitance: 0.1 µF; Applications: General Purpose; componentlink1description: Datasheet; componentlink1url: https://katalog.we-online.de/pbs/datasheet/885012208087.pdf; componentlink2description: DigiKey Link; componentlink2url: https://www.digikey.com/en/products/detail/würth-elektronik/885012208087/5453982; Device Package: 1206 (3216 Metric); lastupdated: 6/4/2024 19:10:27; Lifecycle Status: Active; Minimum Order: 1; Mounting Type: Surface Mount, MLCC; Operating Temperature: -55°C ~ 125°C; Package / Case: 1206 (3216 Metric); packaging: TapeAndReel; partid: 20879; Part Status: Active; price: 0.06; series: WCAP-CSGP; Size / Dimension: 0.126" L x 0.063" W (3.20mm x 1.60mm); Supplier 1: DigiKey; Supplier Part Number 1: 732-8127-1-ND; Temperature Coefficient: X7R; Thickness (Max): 0.035" (0.90mm); value: 0.1 µF; Voltage - Rated: 50V
D1 = SD15C-01FTG: TVS Diode (Bi-directional); Manufacturer_Name: LITTELFUSE; Datasheet Link: https://www.arrow.com/en/products/sd15c-01ftg/littelfuse; Height: 1.14mm; Manufacturer_Part_Number: SD15C-01FTG; Mouser Part Number: 576-SD15C-01FTG; Mouser Price/Stock: https://www.mouser.co.uk/ProductDetail/Littelfuse/SD15C-01FTG?qs=4zl93aaztU8pjSvpxpJP6g%3D%3D; Arrow Part Number: SD15C-01FTG; Arrow Price/Stock: https://www.arrow.com/en/products/sd15c-01ftg/littelfuse?region=nac
D2 = AQW05C-01FTG: TVS Diode (Bi-directional); Manufacturer_Name: LITTELFUSE; Datasheet Link: https://www.littelfuse.com/media?resourcetype=datasheets&itemid=80ae0bbb-a157-46a1-97eb-84c82c82e9e5&filename=littelfuse-tvs-diode-array-aqw05c-01ftg-datasheet; Height: 1mm; Manufacturer_Part_Number: AQW05C-01FTG; Mouser Part Number: 576-AQW05C-01FTG; Mouser Price/Stock: https://www.mouser.co.uk/ProductDetail/Littelfuse/AQW05C-01FTG?qs=Z%252BL2brAPG1JHH8XKoKQPyw%3D%3D
F1 = 0ZCH0005FF2E: Fuse; Manufacturer_Name: Bel; Datasheet Link: https://www.belfuse.com/resources/datasheets/circuitprotection/ds-cp-0zch-series.pdf; Height: 1.15mm; Manufacturer_Part_Number: 0ZCH0005FF2E; Mouser Part Number: 530-0ZCH0005FF2E
IC1 IC2 = LM431CCM3/NOPB: Integrated Circuit; Manufacturer_Name: Texas Instruments; Datasheet Link: http://www.ti.com/lit/gpn/lm431; Height: 1.12mm; Manufacturer_Part_Number: LM431CCM3/NOPB; Mouser Part Number: 926-LM431CCM3/NOPB; Mouser Price/Stock: https://www.mouser.co.uk/ProductDetail/Texas-Instruments/LM431CCM3-NOPB?qs=QbsRYf82W3GICygfDXnqiw%3D%3D; Arrow Part Number: LM431CCM3/NOPB; Arrow Price/Stock: https://www.arrow.com/en/products/lm431ccm3nopb/texas-instruments?utm_currency=USD&region=nac
IC5 = LM321SN3T1G: Integrated Circuit; Manufacturer_Name: onsemi; Datasheet Link: https://www.onsemi.com/pub/Collateral/LM321-D.PDF; Height: 1.1mm; Manufacturer_Part_Number: LM321SN3T1G; Mouser Part Number: 863-LM321SN3T1G; Mouser Price/Stock: https://www.mouser.co.uk/ProductDetail/onsemi/LM321SN3T1G?qs=slMPpRTKD5qNVsCzBsHVZA%3D%3D; Arrow Part Number: LM321SN3T1G; Arrow Price/Stock: https://www.arrow.com/en/products/lm321sn3t1g/on-semiconductor?utm_currency=USD&region=nac
J1 = TD-107-G-AA: Connector; Manufacturer_Name: SAMTEC; Datasheet Link: https://suddendocs.samtec.com/catalog_english/td.pdf?_gl=1*1wt4qt0*_ga*MTEzMjQwMzYxOS4xNjk3ODEzMDcx*_ga_3KFNZC07WW*MTcxMjgzNDUyOC40My4xLjE3MTI4MzQ1ODguNjAuMC4w; Height: 8.18mm; Manufacturer_Part_Number: TD-107-G-AA; Mouser Part Number: 200-TD107GAA; Mouser Price/Stock: https://www.mouser.co.uk/ProductDetail/Samtec/TD-107-G-AA?qs=0lQeLiL1qybxLJvA9lDIZA%3D%3D; Arrow Part Number: TD-107-G-AA; Arrow Price/Stock: https://www.arrow.com/en/products/td-107-g-aa/samtec
J2 = 282837-2: TERM BLK 2P SIDE ENT 5.08MM PCB; Manufacturer: TE Connectivity AMP Connectors; Current: 13.5 A; Mating Orientation: Horizontal with Board; Number of Levels: 1; Pitch: 0.200" (5.08mm); Positions Per Level: 2; Voltage: 300 V; Wire Gauge: 16-28 AWG; Wire Termination: Screw - Rising Cage Clamp; Part Number: 282837-2; Color: Green; ComponentLink1Description: Datasheet; ComponentLink1URL: https://www.te.com/commerce/DocumentDelivery/DDEController?Action=srchrtrv&DocNm=282837&DocType=Customer+Drawing&DocLang=English; ComponentLink2Description: DigiKey Link; ComponentLink2URL: https://www.digikey.com/en/products/detail/te-connectivity-amp-connectors/282837-2/2187973; Features: Interlocking (Side); LastUpdated: 6/21/2022 15:00:23; Lifecycle Status: Active; Minimum Order: 1; Mounting Type: Through Hole; Packaging: Tray; Part Status: Active; Price: 0.31; Series: Buchanan; Supplier 1: DigiKey; Supplier Part Number 1: A113320-ND
J3 J4 J6-J10 J56 = 5001: as J21 on sheet power; Insulation Material: Nylon; Mount: Through Hole; RoHS Compliant: Yes; Series: THM; Height: 0.3inch; Termination: Through Hole; Material: Nylon; Packaging: Bulk; Contact Material: Bronze; REACH SVHC: No SVHC; Contact Plating: Silver; Orientation: Straight; Lead Free: Lead Free; Package Quantity: 100; Length: 7.62mm; Flammability Rating: UL94 V-0; Number of Contacts: 1; Diameter: 2.54mm; Housing Color: Black; Color: Black; Supplier 1: Mouser; Supplier Part Number 1: 534-5001
J5 = 5414373-1: Connector; Manufacturer_Name: TE Connectivity; Datasheet Link: https://www.te.com/commerce/DocumentDelivery/DDEController?Action=srchrtrv&DocNm=1307191_BNC_Connectors&DocType=Catalog%20Section&DocLang=English&PartCntxt=5414373-1&DocFormat=pdf; Height: 8.64mm; Manufacturer_Part_Number: 5414373-1; Mouser Part Number: 571-5414373-1; Mouser Price/Stock: https://www.mouser.co.uk/ProductDetail/TE-Connectivity/5414373-1?qs=TEPVm9Ho6Ekg6JV7ffLu5g%3D%3D; Arrow Part Number: 5414373-1; Arrow Price/Stock: https://www.arrow.com/en/products/5414373-1/te-connectivity?utm_currency=USD&region=nac
J11 = PRT-12807: Connector; Manufacturer_Name: SparkFun; Datasheet Link: https://cdn.sparkfun.com/datasheets/Prototyping/00989.pdf; Height: 8.84mm; Manufacturer_Part_Number: PRT-12807; Mouser Part Number: 474-PRT-12807; Mouser Price/Stock: https://www.mouser.co.uk/ProductDetail/SparkFun/PRT-12807?qs=WyAARYrbSnYnpz4kKzOm4A%3D%3D; Arrow Part Number: PRT-12807; Arrow Price/Stock: https://www.arrow.com/en/products/prt-12807/sparkfun-electronics
R1 R6 = ERA-3AEB302V: Resistor; Manufacturer_Name: Panasonic; Datasheet Link: https://industrial.panasonic.com/cdbs/www-data/pdf/RDM0000/AOA0000C307.pdf; Height: 0.55mm; Manufacturer_Part_Number: ERA-3AEB302V; Mouser Part Number: 667-ERA-3AEB302V; Mouser Price/Stock: https://www.mouser.co.uk/ProductDetail/Panasonic/ERA-3AEB302V?qs=NcBTt3PsE6X1AHNczabKdw%3D%3D; Arrow Part Number: ERA-3AEB302V; Arrow Price/Stock: https://www.arrow.com/en/products/era-3aeb302v/panasonic?utm_currency=USD&region=nac
R2 R5 = TNPW06037K96BEEA: Resistor; Manufacturer_Name: Panasonic; Manufacturer_Part_Number: ERA-3AEB302V; Datasheet Link: https://industrial.panasonic.com/cdbs/www-data/pdf/RDM0000/AOA0000C307.pdf; Height: 0.55mm; Mouser Part Number: 667-ERA-3AEB302V; Mouser Price/Stock: https://www.mouser.co.uk/ProductDetail/Panasonic/ERA-3AEB302V?qs=NcBTt3PsE6X1AHNczabKdw%3D%3D; Arrow Part Number: ERA-3AEB302V; Arrow Price/Stock: https://www.arrow.com/en/products/era-3aeb302v/panasonic?utm_currency=USD&region=nac
R3 R4 = RT0603BRD0724K6L: Resistor; Manufacturer_Name: Panasonic; Manufacturer_Part_Number: ERA-3AEB302V; Datasheet Link: https://industrial.panasonic.com/cdbs/www-data/pdf/RDM0000/AOA0000C307.pdf; Height: 0.55mm; Mouser Part Number: 667-ERA-3AEB302V; Mouser Price/Stock: https://www.mouser.co.uk/ProductDetail/Panasonic/ERA-3AEB302V?qs=NcBTt3PsE6X1AHNczabKdw%3D%3D; Arrow Part Number: ERA-3AEB302V; Arrow Price/Stock: https://www.arrow.com/en/products/era-3aeb302v/panasonic?utm_currency=USD&region=nac
R7 R13 R14 = ERA-8AEB202V: RES SMD 2K OHM 0.1% 1/4W 1206; Manufacturer: Panasonic Electronic Components; Power (Watts): 0.25W, 1/4W; Temperature Coefficient: ±25ppm/°C; Part Number: ERA-8AEB202V; ComponentLink1Description: Datasheet; ComponentLink1URL: https://industrial.panasonic.com/cdbs/www-data/pdf/RDM0000/AOA0000C307.pdf; ComponentLink2Description: DigiKey Link; ComponentLink2URL: https://www.digikey.com/en/products/detail/panasonic-electronic-components/ERA-8AEB202V/3070866; Composition: Thin Film; Device Package: 1206 (3216 Metric); Features: Automotive AEC-Q200; Height - Seated (Max): 0.028" (0.70mm); LastUpdated: 2/9/2024 20:54:17; Lifecycle Status: Active; Minimum Order: 1; Number of Terminations: 2; Operating Temperature: -55°C ~ 155°C; Package / Case: 1206 (3216 Metric); Packaging: TapeAndReel; PartId: 34011; Part Status: Active; Price: 0.10; Ratings: AEC-Q200; Resistance: 2 kOhms; Series: ERA-8A; Size / Dimension: 0.126" L x 0.063" W (3.20mm x 1.60mm); Supplier 1: DigiKey; Supplier Part Number 1: P2.0KBCCT-ND; Supplier Device Package: 1206; Tolerance: ±0.1%; Value: 2 kOhms
R9 R10 = RT1206FRE072K2L: Resistor; Manufacturer_Name: YAGEO; Datasheet Link: https://www.mouser.com/datasheet/2/447/PYu_RT_1_to_0_01_RoHS_L_12-3003070.pdf; Height: 0.65mm; Manufacturer_Part_Number: RT1206FRE072K2L; Mouser Part Number: 603-RT1206FRE072K2L; Mouser Price/Stock: https://www.mouser.co.uk/ProductDetail/YAGEO/RT1206FRE072K2L?qs=yNCrj0CQcyJif6VASMbdeQ%3D%3D; Arrow Part Number: RT1206FRE072K2L; Arrow Price/Stock: https://www.arrow.com/en/products/rt1206fre072k2l/yageo?utm_currency=USD&region=nac
R11 R12 = RT1206BRD07400RL: Resistor; Manufacturer_Name: YAGEO; Datasheet Link: https://www.mouser.fr/datasheet/2/447/PYu_RT_1_to_0_01_RoHS_L_15-3461507.pdf; Height: 0.65mm; Manufacturer_Part_Number: RT1206BRD07400RL; Mouser Part Number: 603-RT1206BRD07400RL; Mouser Price/Stock: https://www.mouser.co.uk/ProductDetail/YAGEO/RT1206BRD07400RL?qs=NgbZBzc1CyGp8d%2FABgImbQ%3D%3D; Arrow Part Number: RT1206BRD07400RL; Arrow Price/Stock: null?region=nac
R79 = TFHP1206D-50RFT5: Resistor; Manufacturer_Name: TT Electronics; Datasheet Link: https://www.ttelectronics.com/TTElectronics/media/ProductFiles/Datasheet/TFHP.pdf; Height: 0.58mm; Manufacturer_Part_Number: TFHP1206D-50RFT5; Mouser Part Number: 756-TFHP1206B-50RFT5; Mouser Price/Stock: https://www.mouser.co.uk/ProductDetail/Welwyn-Components-TT-Electronics/TFHP1206D-50RFT5?qs=amGC7iS6iy%252ByF%2Fp2IEHb1w%3D%3D
TP1 TP2 = S1751-46R: Test Point; Manufacturer_Name: Harwin; Datasheet Link: https://cdn.harwin.com/pdfs/S1751R.pdf; Height: 2mm; Manufacturer_Part_Number: S1751-46R; Mouser Part Number: 855-S1751-46R; Mouser Price/Stock: https://www.mouser.co.uk/ProductDetail/Harwin/S1751-46R?qs=l6ZPVqNVZb71wETAKrfRig%3D%3D